# EAGLE design projet_micro_co (EAGLE 8.3.2)
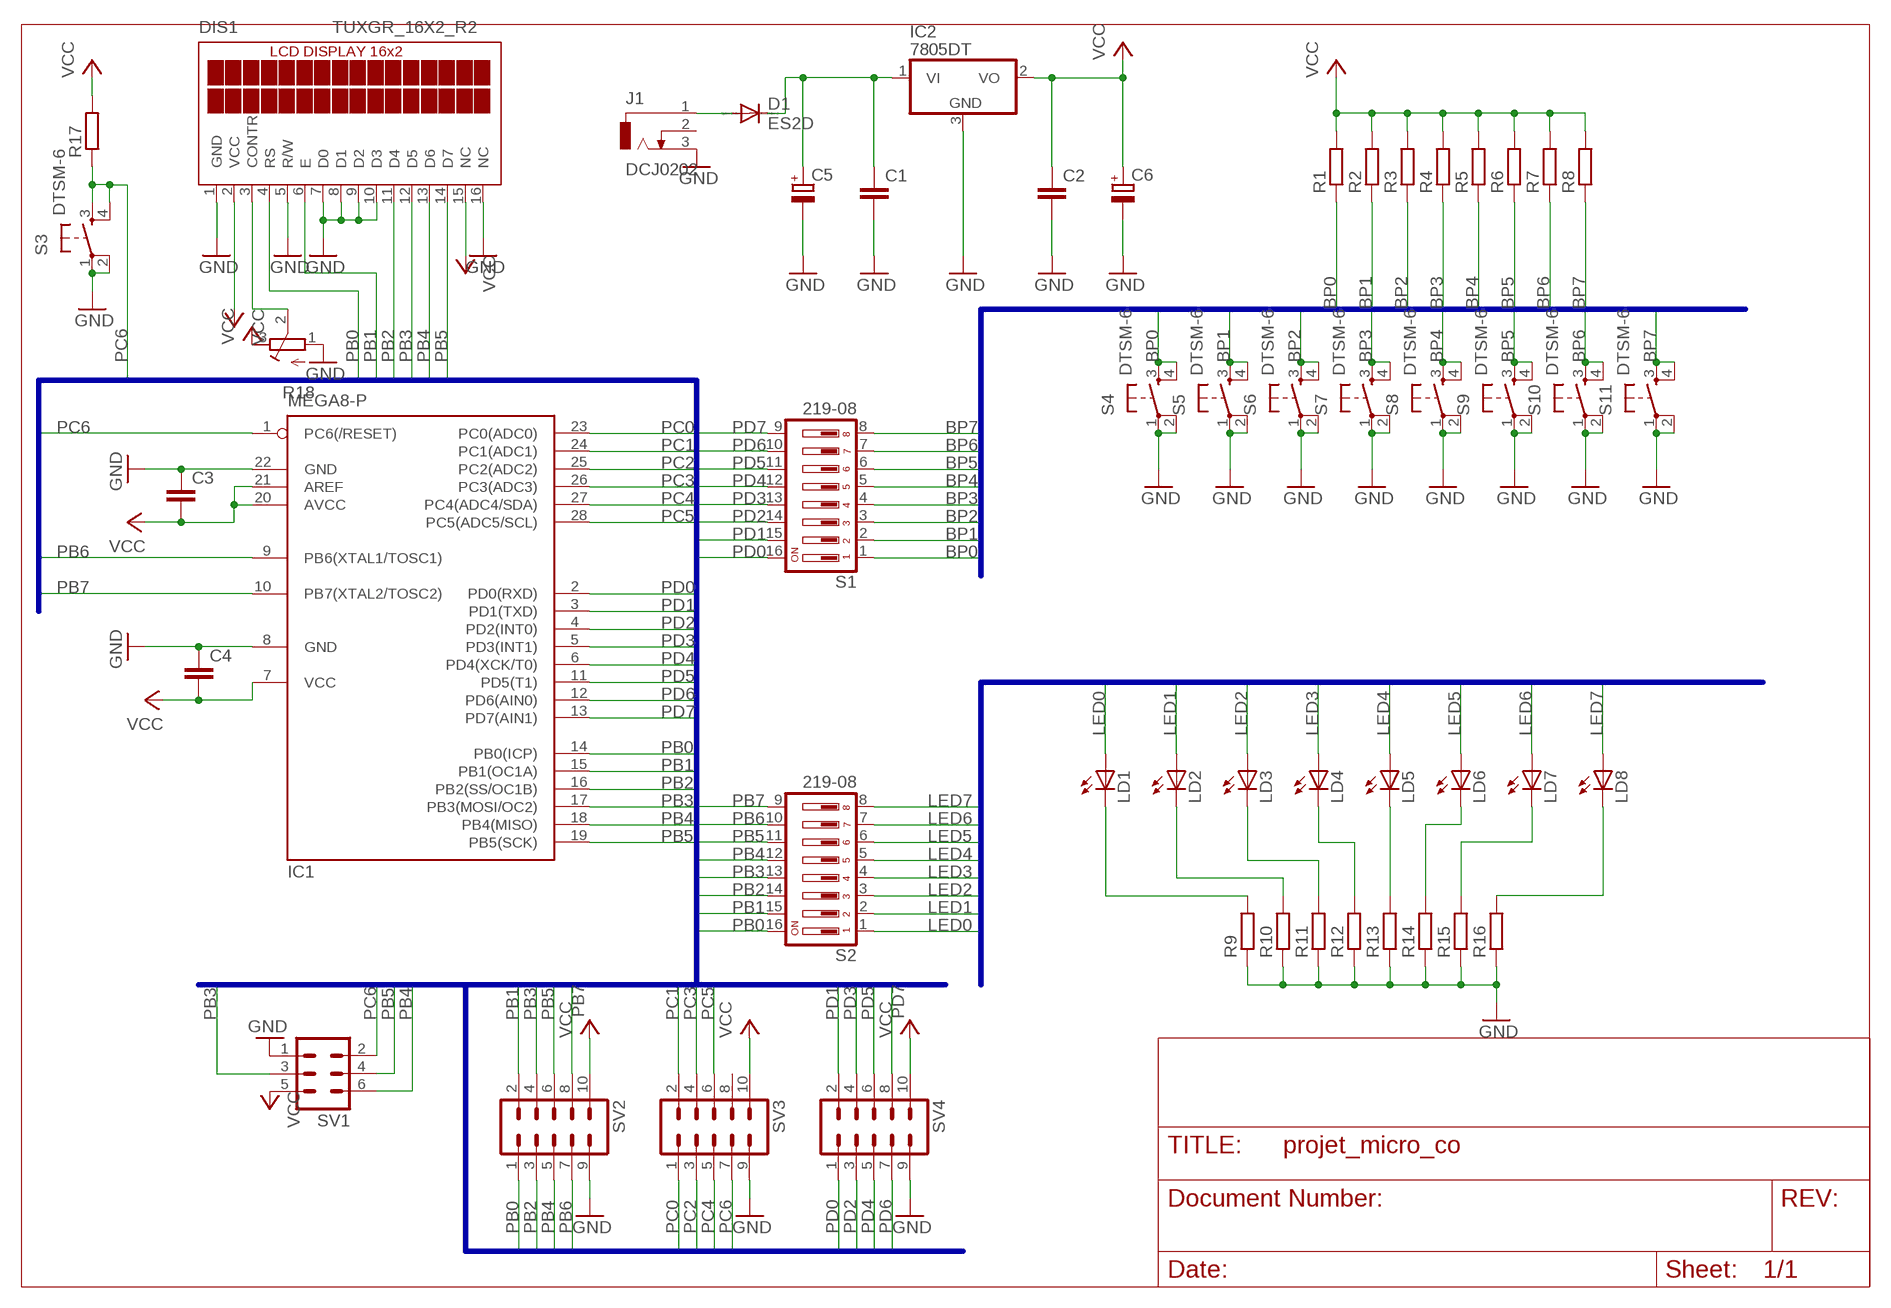
[diagram p0: schematic, sheet 1]

## Parts
C1  C-EUC1206  [C1206]
C2  C-EUC1206  [C1206]
C3  C-EUC1206  [C1206]
C4  C-EUC1206  [C1206]
C5  CPOL-EU153CLV-1010  [153CLV-1010]
C6  CPOL-EU153CLV-0605  [153CLV-0605]
D1  ES2D  [SMB]
DIS1  TUXGR_16X2_R2  [TUXGR_16X2_R2]
IC1  MEGA8-P  [DIL28-3]
IC2  7805DT  [TO252]
J1  DCJ0202  [DCJ0202]
LD1  LEDCHIPLED_1206  [CHIPLED_1206]
LD2  LEDCHIPLED_1206  [CHIPLED_1206]
LD3  LEDCHIPLED_1206  [CHIPLED_1206]
LD4  LEDCHIPLED_1206  [CHIPLED_1206]
LD5  LEDCHIPLED_1206  [CHIPLED_1206]
LD6  LEDCHIPLED_1206  [CHIPLED_1206]
LD7  LEDCHIPLED_1206  [CHIPLED_1206]
LD8  LEDCHIPLED_1206  [CHIPLED_1206]
R1  R-EU_M1206  [M1206]
R2  R-EU_M1206  [M1206]
R3  R-EU_M1206  [M1206]
R4  R-EU_M1206  [M1206]
R5  R-EU_M1206  [M1206]
R6  R-EU_M1206  [M1206]
R7  R-EU_M1206  [M1206]
R8  R-EU_M1206  [M1206]
R9  R-EU_M1206  [M1206]
R10  R-EU_M1206  [M1206]
R11  R-EU_M1206  [M1206]
R12  R-EU_M1206  [M1206]
R13  R-EU_M1206  [M1206]
R14  R-EU_M1206  [M1206]
R15  R-EU_M1206  [M1206]
R16  R-EU_M1206  [M1206]
R17  R-EU_M1206  [M1206]
R18  R-TRIMM4G/J  [RTRIM4G/J]
S1  219-08  [CTS-219-08]
S2  219-08  [CTS-219-08]
S3  DTSM-6  [DTSM-6]
S4  DTSM-6  [DTSM-6]
S5  DTSM-6  [DTSM-6]
S6  DTSM-6  [DTSM-6]
S7  DTSM-6  [DTSM-6]
S8  DTSM-6  [DTSM-6]
S9  DTSM-6  [DTSM-6]
S10  DTSM-6  [DTSM-6]
S11  DTSM-6  [DTSM-6]
SV1  ML6  [ML6]
SV2  MA05-2  [MA05-2]
SV3  MA05-2  [MA05-2]
SV4  MA05-2  [MA05-2]

## Nets
BP0: R1.1 S1.1 S4.3 S4.4
BP1: R2.1 S1.2 S5.3 S5.4
BP2: R3.1 S1.3 S6.3 S6.4
BP3: R4.1 S1.4 S7.3 S7.4
BP4: R5.1 S1.5 S8.3 S8.4
BP5: R6.1 S1.6 S9.3 S9.4
BP6: R7.1 S1.7 S10.3 S10.4
BP7: R8.1 S1.8 S11.3 S11.4
GND: C1.2 C2.2 C3.1 C4.1 C5.- C6.- DIS1.1(GND) DIS1.5(R/W) DIS1.7(D0) DIS1.8(D1) DIS1.9(D2) DIS1.10(D3) DIS1.16(NC) IC1.8(GND) IC1.22(GND) IC2.3(GND) J1.3 R9.1 R10.1 R11.1 R12.1 R13.1 R14.1 R15.1 R16.1 R18.1(A) S3.1 S3.2 S4.1 S4.2 S5.1 S5.2 S6.1 S6.2 S7.1 S7.2 S8.1 S8.2 S9.1 S9.2 S10.1 S10.2 S11.1 S11.2 SV1.1 SV2.9 SV3.9 SV4.9
LED0: LD1.A S2.1
LED1: LD2.A S2.2
LED2: LD3.A S2.3
LED3: LD4.A S2.4
LED4: LD5.A S2.5
LED5: LD6.A S2.6
LED6: LD7.A S2.7
LED7: LD8.A S2.8
N$1: DIS1.3(CONTR) R18.2(S)
N$2: D1.A J1.1
N$3: C1.1 C5.+ D1.C IC2.1(VI)
N$4: LD1.C R9.2
N$5: LD2.C R10.2
N$6: LD3.C R11.2
N$7: LD4.C R12.2
N$8: LD5.C R13.2
N$9: LD6.C R14.2
N$10: LD7.C R15.2
N$11: LD8.C R16.2
PB0: DIS1.4(RS) IC1.14(PB0(ICP)) S2.16 SV2.1
PB1: DIS1.6(E) IC1.15(PB1(OC1A)) S2.15 SV2.2
PB2: DIS1.11(D4) IC1.16(PB2(SS/OC1B)) S2.14 SV2.3
PB3: DIS1.12(D5) IC1.17(PB3(MOSI/OC2)) S2.13 SV1.3 SV2.4
PB4: DIS1.13(D6) IC1.18(PB4(MISO)) S2.12 SV1.6 SV2.5
PB5: DIS1.14(D7) IC1.19(PB5(SCK)) S2.11 SV1.4 SV2.6
PB6: IC1.9(PB6(XTAL1/TOSC1)) S2.10 SV2.7
PB7: IC1.10(PB7(XTAL2/TOSC2)) S2.9 SV2.8
PC0: IC1.23(PC0(ADC0)) SV3.1
PC1: IC1.24(PC1(ADC1)) SV3.2
PC2: IC1.25(PC2(ADC2)) SV3.3
PC3: IC1.26(PC3(ADC3)) SV3.4
PC4: IC1.27(PC4(ADC4/SDA)) SV3.5
PC5: IC1.28(PC5(ADC5/SCL)) SV3.6
PC6: IC1.1(PC6(/RESET)) R17.1 S3.3 S3.4 SV1.2 SV3.7
PD0: IC1.2(PD0(RXD)) S1.16 SV4.1
PD1: IC1.3(PD1(TXD)) S1.15 SV4.2
PD2: IC1.4(PD2(INT0)) S1.14 SV4.3
PD3: IC1.5(PD3(INT1)) S1.13 SV4.4
PD4: IC1.6(PD4(XCK/T0)) S1.12 SV4.5
PD5: IC1.11(PD5(T1)) S1.11 SV4.6
PD6: IC1.12(PD6(AIN0)) S1.10 SV4.7
PD7: IC1.13(PD7(AIN1)) S1.9 SV4.8
VCC: C2.1 C3.2 C4.2 C6.+ DIS1.2(VCC) DIS1.15(NC) IC1.7(VCC) IC1.20(AVCC) IC1.21(AREF) IC2.2(VO) R1.2 R2.2 R3.2 R4.2 R5.2 R6.2 R7.2 R8.2 R17.2 R18.3(E) SV1.5 SV2.10 SV3.10 SV4.10
Unconnected: J1.2 SV3.8

## Buses
PB[0..7],PC[0..7],PD[0..7]
BP[0..7]
LED[0..7]

## Library data of the parts
C1-C4 = rcl:C-EU: CAPACITOR, European symbol
C5 C6 = rcl:CPOL-EU: POLARIZED CAPACITOR, European symbol
D1 = diode:ES2D: DIODE super fast rectifier, 2 A
DIS1 = display-lcd:TUXGR_16X2_R2: Tuxgraphics LCD display 16x2 characters reflective, without background light Source: tuxgr_12x2_r2.pdf; OC_FARNELL: unknown; OC_NEWARK: unknown
IC1 = atmel:MEGA8-P: MICROCONTROLLER 8 Kbytes FLASH, 1 kbytes SRAM, 512 bytes EEPROM, USART, 4-channel 10 bit ADC, 2-channel 8 bit ADC Pin compatible with Atmega48, ATMega88, ATMega168 Source: avr.lbr; OC_FARNELL: unknown; OC_NEWARK: unknown
IC2 = linear:78*: Positive VOLTAGE REGULATOR Source: http://cache.national.com/ds/LM/LM78L05.pdf http://www.fairchildsemi.com/ds/LM/LM7805.pdf
J1 = con-jack:DCJ0202: DC POWER JACK Source: DCJ0202.pdf; OC_FARNELL: unknown; OC_NEWARK: unknown
LD1-LD8 = led:LED: LED OSRAM: - CHIPLED LG R971, LG N971, LY N971, LG Q971, LY Q971, LO R971, LY R971 LH N974, LH R974 LS Q976, LO Q976, LY Q976 LO Q996 - Hyper CHIPLED LW Q18S LB Q993, LB Q99A, LB R99A - SideLED LS A670, LO A670, LY A670, LG A670, LP A670 LB A673, LV A673, LT A673, LW A673 LH A674 LY A675 LS A676, LA A676, LO A676, LY A676, LW A676 LS A679, LY A679, LG A679 - Hyper Micro SIDELED® LS Y876, LA Y876, LO Y876, LY Y876 LT Y87S - SmartLED LW L88C, LW L88S LB L89C, LB L89S, LG L890 LS L89K, LO L89K, LY L89K LS L896, LA L896, LO L896, LY L896 - TOPLED LS T670, LO T670, LY T670, LG T670, LP T670 LSG T670, LSP T670, LSY T670, LOP T670, LYG T670 LG T671, LOG T671, LSG T671 LB T673, LV T673, LT T673, LW T673 LH T674 LS T676, LA T676, LO T676, LY T676, LB T676, LH T676, LSB T676, LW T676 LB T67C, LV T67C, LT T67C, LS T67K, LO T67K, LY T67K, LW E67C LS E67B, LA E67B, LO E67B, LY E67B, LB E67C, LV E67C, LT E67C LW T67C LS T679, LY T679, LG T679 LS T770, LO T770, LY T770, LG T770, LP T770 LB T773, LV T773, LT T773, LW T773 LH T774 LS E675, LA E675, LY E675, LS T675 LS T776, LA T776, LO T776, LY T776, LB T776 LHGB T686 LT T68C, LB T68C - Hyper Mini TOPLED® LB M676 - Mini TOPLED Santana® LG M470 LS M47K, LO M47K, LY M47K Source: http://www.osram.convergy.de/
R1-R17 = rcl:R-EU_: RESISTOR, European symbol
R18 = rcl:R-TRIMM: Trimm resistor
S1 S2 = switch-dil:219-08*: Surface Mount DIP Switch Series 219 SMT CTS Electronic Components Sourc: www.ctscorp.com; OC_FARNELL: unknown; OC_NEWARK: unknown
S3-S11 = switch-tact:DTSM-6
SV1 = con-ml:ML6: HARTING; OC_FARNELL: unknown; OC_NEWARK: unknown
SV2-SV4 = con-lstb:MA05-2: PIN HEADER; OC_FARNELL: unknown; OC_NEWARK: unknown

## Net classes
0 default: width 0.406 mm, drill 0.254 mm, clearance 0.305 mm
1 ground: width 0.61 mm, drill 0.254 mm, clearance 0.305 mm

## Board
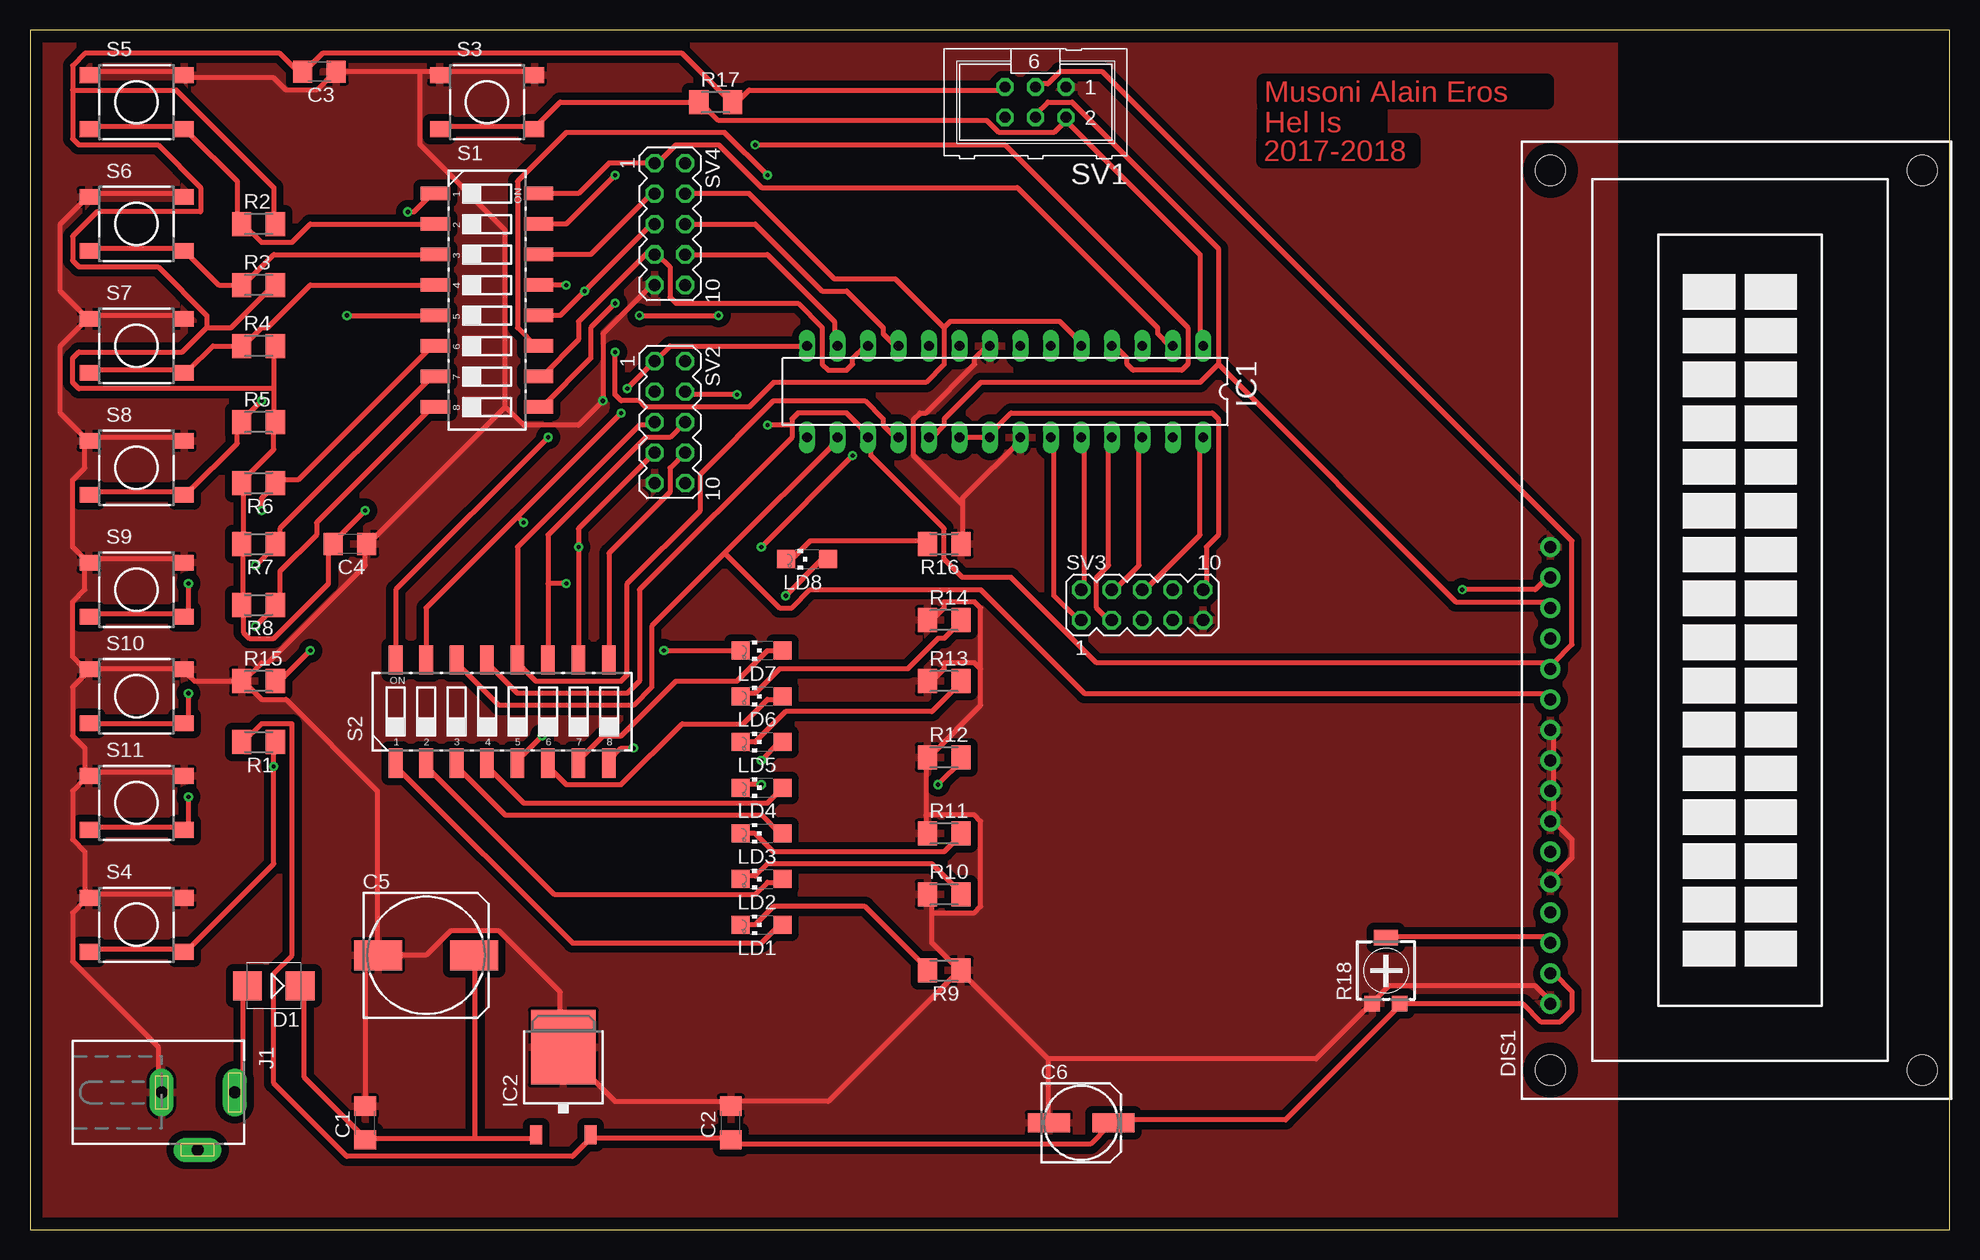
[diagram p1: board, top side]
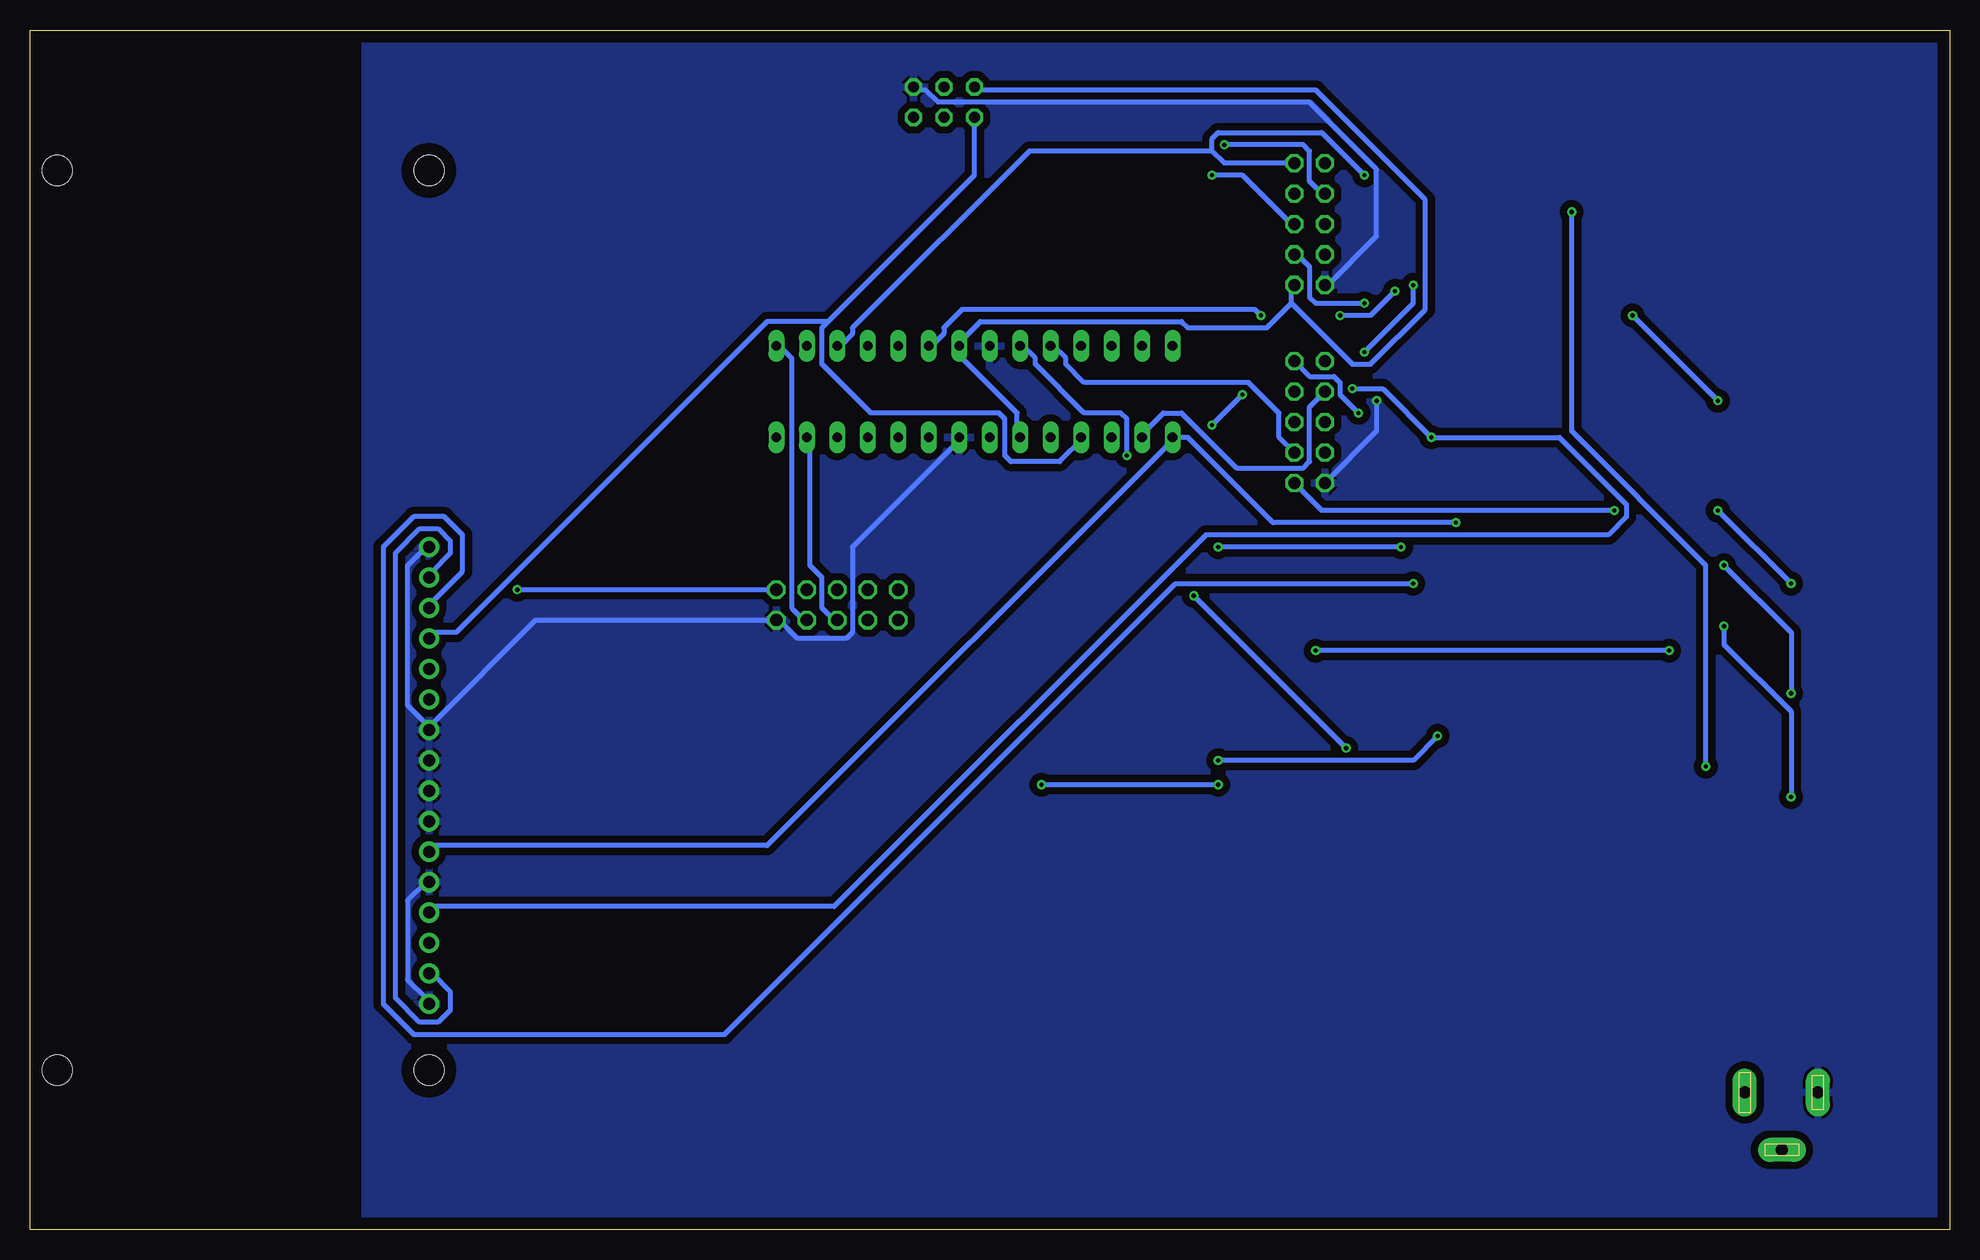
[diagram p2: board, bottom side, seen from below]

Size 160 x 100 mm. Coordinates in mm from the lower left corner, seen from the top.
Outline: 0,0 160,0 160,100 0,100 0,0
Copper layers (1*16): Top 0.035mm / dielectric 1.5mm / Bottom 0.035mm
Design rules "default *": minimum track width 6mil, minimum drill 0.35mm, track to track 24mil, track to pad 10mil, pad to pad 6mil, via to via 6mil, smd to smd 6mil, copper to edge 40mil, drill to drill 6mil, minimum pad ring 10mil, minimum via ring 8mil, stop-mask expansion 4mil, vias tented up to drill 0mil, thermal gap 10mil

### Footprints (pad centres in the part's own frame; a part is rotated, then mirrored left to right if it is on the bottom)
C1206 = smd 1.6 x 1.8: 1 -1.4,0; 2 1.4,0
153CLV-1010 = smd 4 x 2.5: + 4,0; - -4,0
153CLV-0605 = smd 3.5 x 1.6: + 2.7,0; - -2.7,0
SMB = smd 2.4 x 2.4: A 2.2,0; C -2.2,0
TUXGR_16X2_R2 = drill 1 pad 1.676: 1 -32,15.5; 2 -29.46,15.5; 3 -26.92,15.5; 4 -24.38,15.5; 5 -21.84,15.5; 6 -19.3,15.5; 7 -16.76,15.5; 8 -14.22,15.5; 9 -11.68,15.5; 10 -9.14,15.5; 11 -6.6,15.5; 12 -4.06,15.5; 13 -1.52,15.5; 14 1.02,15.5; 15 3.56,15.5; 16 6.1,15.5 | hole 2.5: -37.5,-15.5; 37.5,-15.5; -37.5,15.5; 37.5,15.5
DIL28-3 = drill 0.813 long: 1 -16.51,-3.81; 2 -13.97,-3.81; 3 -11.43,-3.81; 4 -8.89,-3.81; 5 -6.35,-3.81; 6 -3.81,-3.81; 7 -1.27,-3.81; 8 1.27,-3.81; 9 3.81,-3.81; 10 6.35,-3.81; 11 8.89,-3.81; 12 11.43,-3.81; 13 13.97,-3.81; 14 16.51,-3.81; 15 16.51,3.81; 16 13.97,3.81; 17 11.43,3.81; 18 8.89,3.81; 19 6.35,3.81; 20 3.81,3.81; 21 1.27,3.81; 22 -1.27,3.81; 23 -3.81,3.81; 24 -6.35,3.81; 25 -8.89,3.81; 26 -11.43,3.81; 27 -13.97,3.81; 28 -16.51,3.81
TO252 = smd 1 x 1.6: 1 -2.28,-4.8; 2 2.28,-4.8 | smd 5.4 x 6.2: 3 0,2.5
DCJ0202 = drill 1 pad 2 long: 1 0,3.1; 2 4.8,0; 3 0,-3
CHIPLED_1206 = smd 1.5 x 1.5: A 0,-1.75; C 0,1.75
M1206 = smd 1.6 x 2: 1 -1.4,0; 2 1.4,0
RTRIM4G/J = smd 1.3 x 1.3: 1 -1.15,-2.75; 3 1.15,-2.75 | smd 2 x 1.3: 2 0,2.75
CTS-219-08 = smd 1.13 x 2.44: 1 -8.89,-4.3; 2 -6.35,-4.3; 3 -3.81,-4.3; 4 -1.27,-4.3; 5 1.27,-4.3; 6 3.81,-4.3; 7 6.35,-4.3; 8 8.89,-4.3; 9 8.89,4.3; 10 6.35,4.3; 11 3.81,4.3; 12 1.27,4.3; 13 -1.27,4.3; 14 -3.81,4.3; 15 -6.35,4.3; 16 -8.89,4.3
DTSM-6 = smd 1.55 x 1.3: 1 -3.975,2.25; 2 3.975,2.25; 3 -3.975,-2.25; 4 3.975,-2.25
ML6 = drill 0.914 octagon: 1 -2.54,-1.27; 2 -2.54,1.27; 3 0,-1.27; 4 0,1.27; 5 2.54,-1.27; 6 2.54,1.27
MA05-2 = drill 1.016 octagon: 1 -5.08,-1.27; 2 -5.08,1.27; 3 -2.54,-1.27; 4 -2.54,1.27; 5 0,-1.27; 6 0,1.27; 7 2.54,-1.27; 8 2.54,1.27; 9 5.08,-1.27; 10 5.08,1.27

### Placement (x,y rotation side)
C1  27.94,8.89 90 top
C2  58.42,8.89 90 top
C3  24.13,96.52 180 top
C4  26.67,57.15 180 top
C5  33.02,22.86 0 top
C6  87.63,8.89 0 top
D1  20.32,20.32 180 top
DIS1  142.24,50.8 90 top
IC1  81.28,69.85 180 top
IC2  44.45,12.7 0 top
J1  13.97,11.43 270 top
LD1  60.96,25.4 90 top
LD2  60.96,29.21 90 top
LD3  60.96,33.02 90 top
LD4  60.96,36.83 90 top
LD5  60.96,40.64 90 top
LD6  60.96,44.45 90 top
LD7  60.96,48.26 90 top
LD8  64.77,55.88 90 top
R1  19.05,40.64 180 top
R2  19.05,83.82 0 top
R3  19.05,78.74 0 top
R4  19.05,73.66 0 top
R5  19.05,67.31 0 top
R6  19.05,62.23 180 top
R7  19.05,57.15 180 top
R8  19.05,52.07 180 top
R9  76.2,21.59 180 top
R10  76.2,27.94 0 top
R11  76.2,33.02 0 top
R12  76.2,39.37 0 top
R13  76.2,45.72 0 top
R14  76.2,50.8 0 top
R15  19.05,45.72 0 top
R16  76.2,57.15 180 top
R17  57.15,93.98 0 top
R18  113.03,21.59 0 top
S1  38.1,77.47 270 top
S2  39.37,43.18 0 top
S3  38.1,93.98 0 top
S4  8.89,25.4 0 top
S5  8.89,93.98 0 top
S6  8.89,83.82 0 top
S7  8.89,73.66 0 top
S8  8.89,63.5 0 top
S9  8.89,53.34 0 top
S10  8.89,44.45 0 top
S11  8.89,35.56 0 top
SV1  83.82,93.98 180 top
SV2  53.34,67.31 270 top
SV3  92.71,52.07 0 top
SV4  53.34,83.82 270 top

### Tracks (layer width: path | path; a pad name or v marks a point on that pad's centre or on a via)
BP0  (via drill 0.35)
  Top 0.406: S4.3 5.08,23.37 12.7,23.37 S4.4 13.21,23.37 20.32,30.48 v20.32,38.61 20.32,40.64 R1.1 | v31.5,84.84 32,84.84 33.53,86.36 S1.1
  Bottom 0.406: v31.5,84.84 31.5,66.55 20.32,55.37 v20.32,38.61
BP1
  Top 0.406: S5.3 5.08,91.95 12.7,91.95 S5.4 13.21,91.44 17.27,87.38 17.27,83.82 R2.1 17.78,83.82 19.3,82.3 21.84,82.3 23.37,83.82 S1.2
BP2
  Top 0.406: S6.3 5.08,81.79 12.7,81.79 S6.4 13.21,81.28 15.75,78.74 R3.1 17.78,78.74 20.32,81.28 S1.3
BP3
  Top 0.406: S7.3 5.08,71.63 12.7,71.63 S7.4 13.21,71.63 15.24,73.66 R4.1 17.78,73.66 19.3,75.18 19.81,75.18 23.37,78.74 S1.4
BP4  (via drill 0.35)
  Top 0.406: S8.3 5.08,61.47 12.7,61.47 S8.4 13.21,61.47 17.27,65.53 17.27,67.06 R5.1 17.78,67.56 v19.3,69.09 | v26.42,76.2 S1.5
  Bottom 0.406: v19.3,69.09 v26.42,76.2
BP5  (via drill 0.35)
  Top 0.406: S9.3 5.08,51.31 12.7,51.31 S9.4 13.21,51.31 v13.21,53.85 | S1.6 33.53,73.66 22.35,62.48 20.83,62.48 R6.1 20.32,61.98 19.3,60.96 v19.3,59.94
  Bottom 0.406: v19.3,59.94 v13.21,53.85
BP6  (via drill 0.35)
  Top 0.406: S10.3 5.08,42.16 12.7,42.16 S10.4 13.21,42.67 v13.21,44.7 | S1.7 33.53,71.12 20.83,58.42 20.83,57.4 R7.1 20.32,56.9 v18.8,55.37
  Bottom 0.406: v13.21,44.7 13.21,49.78 v18.8,55.37
BP7  (via drill 0.35)
  Top 0.406: S11.3 5.08,33.53 12.7,33.53 S11.4 13.21,33.53 v13.21,36.07 | S1.8 33.53,68.58 23.88,58.93 23.88,57.91 20.83,54.86 20.83,52.32 R8.1 20.32,51.82 v18.8,50.29
  Bottom 0.406: v13.21,36.07 13.21,43.18 18.8,48.77 v18.8,50.29
GND  (via drill 0.35)
  Top 0.406: C1.2 27.94,21.84 28.96,22.86 | 58.42,10.67 48.77,10.67 44.7,14.73 IC2.3 44.2,15.24 44.2,19.81 39.12,24.89 35.05,24.89 33.02,22.86 C5.- 28.96,22.86 | 74.68,34.54 74.68,39.12 R12.1 75.18,39.62 79.25,43.69 79.25,46.74 | 74.68,34.54 74.68,33.02 R11.1 | 79.25,46.74 78.74,47.24 76.2,47.24 76.2,46.74 75.18,45.72 R13.1 | 79.25,46.74 79.25,51.82 78.74,52.32 76.2,52.32 76.2,51.82 75.18,50.8 R14.1 | 75.18,26.42 75.18,23.88 77.22,21.84 R9.1 | 75.18,26.42 75.18,27.94 R10.1 | 84.84,14.22 84.84,9.14 C6.- | 84.84,14.22 77.72,21.34 R9.1 | 74.68,34.54 78.74,34.54 79.25,34.04 79.25,26.92 78.74,26.42 75.18,26.42 | 58.42,10.67 66.55,10.67 77.22,21.34 R9.1 | 58.42,10.67 C2.2 | 77.72,60.45 77.72,60.96 82.8,66.04 IC1.22 | 77.72,60.45 77.72,57.4 R16.1 | 77.72,60.45 73.66,64.52 73.66,67.56 74.17,68.07 74.68,68.07 78.74,72.14 78.74,72.64 79.76,73.66 IC1.8 | DIS1.1 126.49,19.3 125.48,20.32 113.28,20.32 112.27,19.3 R18.1 111.76,18.8 107.19,14.22 84.84,14.22 | DIS1.5 127,29.46 128.52,30.99 128.52,32.51 127,34.04 DIS1.7 127,34.54 127,36.58 DIS1.8 127,37.08 127,39.12 DIS1.9 127,39.62 127,41.66 DIS1.10 | S4.1 5.08,27.94 12.7,27.94 S4.2 | J1.3 10.67,11.68 10.67,15.24 3.56,22.35 3.56,26.42 4.57,27.43 S4.1 | 17.78,45.72 19.3,47.24 19.81,47.24 27.94,55.37 27.94,56.9 C4.1 28.45,57.4 39.62,68.58 | S6.2 12.7,86.36 5.08,86.36 S6.1 4.57,85.85 2.54,83.82 2.54,78.23 4.57,76.2 S7.1 | S7.1 5.08,76.2 12.7,76.2 S7.2 | S8.1 5.08,66.04 12.7,66.04 S8.2 | S9.1 5.08,55.88 12.7,55.88 S9.2 | S11.1 5.08,38.1 12.7,38.1 S11.2 | S10.1 5.08,46.74 12.7,46.74 S10.2 13.21,46.23 13.72,45.72 R15.1 17.78,45.72 | S11.1 4.57,38.1 4.57,40.13 3.56,41.15 3.56,45.21 4.57,46.23 S10.1
  Top 0.406: S9.1 4.57,55.37 4.57,53.34 3.56,52.32 3.56,47.75 4.57,46.74 S10.1 | S8.1 4.57,65.53 4.57,63.5 3.56,62.48 3.56,56.9 4.57,55.88 S9.1 | S7.1 4.57,75.69 2.54,73.66 2.54,68.07 4.57,66.04 S8.1 | S4.1 4.57,27.94 4.57,31.5 3.56,32.51 3.56,36.58 4.57,37.59 S11.1 | S5.1 5.08,96.52 12.7,96.52 S5.2 13.21,96.01 20.32,96.01 21.34,95 23.88,95 25.4,96.52 C3.1 32.51,96.52 | S3.2 41.66,96.52 34.54,96.52 S3.1 34.04,96.52 32.51,96.52 | SV4.9 51.82,78.74 47.75,74.68 v47.75,69.09 45.72,67.06 41.15,67.06 39.62,68.58 | 32.51,96.52 32.51,90.42 39.62,83.31 39.62,68.58 | 28.96,22.86 28.96,36.58 21.34,44.2 19.3,44.2 17.78,45.72
  Bottom 0.406: IC1.22 82.3,66.04 91.44,56.9 91.44,49.78 91.95,49.28 96.01,49.28 97.54,50.8 SV3.9 117.86,50.8 126.49,42.16 DIS1.10 127,42.16 128.52,43.69 128.52,55.37 127,56.9 DIS1.16 | DIS1.1 127,19.3 128.52,20.83 128.52,27.43 127,28.96 DIS1.5 | SV1.1 86.36,95 85.34,95 84.33,93.98 53.34,93.98 47.75,88.39 47.75,82.8 51.82,78.74 SV4.9 | SV2.9 47.75,66.55 v47.75,69.09
  pour Top: 0.2,99.77 132.08,99.77 132.08,0.61 0.2,0.61
  pour Bottom: 0.2,99.77 132.08,99.77 132.08,0.61 0.2,0.61
LED0
  Top 0.406: LD1.A 62.48,25.4 60.96,23.88 45.21,23.88 30.48,38.61 S2.1
LED1
  Top 0.406: LD2.A 62.48,28.96 61.47,28.96 60.45,27.94 43.69,27.94 33.02,38.61 S2.2
LED2
  Top 0.406: LD3.A 62.48,33.02 60.96,34.54 39.62,34.54 35.56,38.61 S2.3
LED3
  Top 0.406: LD4.A 62.48,36.58 61.47,35.56 41.15,35.56 38.1,38.61 S2.4
LED4  (via drill 0.35)
  Top 0.406: v60.96,39.12 62.48,40.64 LD5.A | v42.67,41.15 40.64,39.12 S2.5
  Bottom 0.406: v60.96,39.12 44.7,39.12 v42.67,41.15
LED5
  Top 0.406: LD6.A 62.48,44.2 61.47,44.2 59.44,42.16 54.36,42.16 49.28,37.08 44.7,37.08 43.18,38.61 S2.6
LED6
  Top 0.406: LD7.A 61.47,48.26 58.93,45.72 53.85,45.72 49.28,41.15 47.75,41.15 45.72,39.12 S2.7
LED7  (via drill 0.35)
  Top 0.406: v62.99,52.83 66.04,55.88 LD8.A | v50.29,40.13 49.28,40.13 48.26,39.12 S2.8
  Bottom 0.406: v50.29,40.13 v62.99,52.83
N$1
  Top 0.406: R18.2 113.28,24.38 126.49,24.38 DIS1.3
N$2
  Top 0.406: D1.A 17.78,20.32 17.78,12.19 17.27,11.68 J1.1
N$3
  Top 0.406: 27.94,7.62 37.08,7.62 | 37.08,7.62 42.16,7.62 IC2.1 | 27.94,7.62 22.86,12.7 22.86,20.32 D1.C | 27.94,7.62 C1.1 | 37.08,7.62 37.08,22.86 C5.+
N$4
  Top 0.406: LD1.C 60.45,25.4 61.98,26.92 69.6,26.92 74.68,21.84 R9.2
N$5
  Top 0.406: LD2.C 59.44,29.46 60.45,29.46 61.47,30.48 75.18,30.48 77.72,27.94 R10.2
N$6
  Top 0.406: LD3.C 60.45,33.02 61.98,31.5 76.2,31.5 77.72,33.02 R11.2
N$7  (via drill 0.35)
  Top 0.406: v60.96,37.08 59.44,37.08 LD4.C | v75.69,37.08 77.72,39.12 R12.2
  Bottom 0.406: v75.69,37.08 v60.96,37.08
N$8
  Top 0.406: LD5.C 60.45,40.64 62.99,43.18 75.18,43.18 77.72,45.72 R13.2
N$9
  Top 0.406: LD6.C 59.44,44.7 60.45,44.7 62.48,46.74 73.15,46.74 75.69,49.28 76.2,49.28 77.72,50.8 R14.2
N$10  (via drill 0.35)
  Top 0.406: v52.83,48.26 LD7.C | v23.37,48.26 20.83,45.72 R15.2
  Bottom 0.406: v23.37,48.26 v52.83,48.26
N$11
  Top 0.406: LD8.C 63.5,55.88 65.02,57.4 74.68,57.4 R16.2
PB0  (via drill 0.35)
  Top 0.406: S2.16 30.48,53.34 v43.18,66.04 | v49.78,70.1 SV2.1 53.34,73.66 IC1.14
  Bottom 0.406: v49.78,70.1 47.24,70.1 v43.18,66.04 32.51,66.04 26.92,60.45 26.92,59.44 28.45,57.91 61.98,57.91 92.96,26.92 126.49,26.92 DIS1.4
PB1  (via drill 0.35)
  Top 0.406: S2.15 33.02,51.82 40.64,59.44 | v49.28,68.07 40.64,59.44 | 40.64,59.44 v41.15,58.93
  Bottom 0.406: v49.28,68.07 50.8,69.6 50.8,70.61 51.31,71.12 53.34,71.12 SV2.2 | 64.52,66.04 63.5,66.04 56.39,58.93 v41.15,58.93 | 64.52,66.04 98.55,32 126.49,32 DIS1.6 | 64.52,66.04 IC1.15
PB2
  Top 0.406: 57.91,56.39 67.56,66.04 IC1.16 | 57.91,56.39 51.82,50.29 51.82,45.21 50.29,43.69 39.12,43.69 35.56,47.24 S2.14 | 57.91,56.39 62.48,51.82 63.5,51.82 65.02,53.34 79.25,53.34 87.88,44.7 126.49,44.7 DIS1.11
  Bottom 0.406: SV2.3 53.34,68.58 53.34,64.01 53.85,63.5 59.44,63.5 64.01,68.07 65.53,68.07 67.56,66.04 IC1.16
PB3  (via drill 0.35)
  Top 0.406: 63.5,67.06 63.5,67.56 64.01,68.07 68.07,68.07 70.1,66.04 | 63.5,67.06 63.5,66.04 50.8,53.34 50.8,45.72 49.78,44.7 40.64,44.7 38.1,47.24 S2.13 | v58.93,69.6 54.86,69.6 SV2.4 | 63.5,67.06 v61.47,67.06 | SV1.3 83.82,95.5 84.84,95.5 85.85,96.52 89.41,96.52 128.52,57.4 128.52,48.77 127,47.24 DIS1.12 126.49,47.24 88.9,47.24 81.79,54.36 77.72,54.36 76.2,55.88 76.2,58.42 70.1,64.52 70.1,66.04 | 70.1,66.04 IC1.17
  Bottom 0.406: v61.47,67.06 v58.93,69.6
PB4
  Top 0.406: SV2.5 51.82,67.06 50.8,67.06 40.64,56.9 S2.12 40.64,47.24 42.16,45.72 49.28,45.72 49.78,46.23 49.78,53.85 55.88,59.94 55.88,62.99 61.98,69.09 69.6,69.09 71.12,67.56 71.12,67.06 72.14,66.04 IC1.18
  Bottom 0.406: SV1.6 81.28,87.88 93.47,75.69 | 93.47,75.69 93.98,75.18 93.98,72.14 89.92,68.07 79.25,68.07 78.74,67.56 78.74,64.52 78.23,64.01 74.17,64.01 72.14,66.04 IC1.18 | 93.47,75.69 98.55,75.69 124.46,49.78 126.49,49.78 DIS1.13
PB5  (via drill 0.35)
  Top 0.406: 43.18,53.85 43.18,57.91 51.31,66.04 53.34,66.04 SV2.6 | 43.18,53.85 S2.11 | 99.06,72.14 97.54,70.61 79.25,70.61 76.2,67.56 76.2,67.06 75.18,66.04 IC1.19 | 99.06,72.14 99.06,81.79 86.87,93.98 84.84,93.98 83.82,92.96 SV1.4 | 99.06,72.14 118.87,52.32 126.49,52.32 DIS1.14 | v44.7,53.85 43.18,53.85
  Bottom 0.406: v44.7,53.85 64.52,53.85 102.11,16.26 128.02,16.26 130.56,18.8 130.56,56.9 128.02,59.44 125.48,59.44 123.95,57.91 123.95,54.86 126.49,52.32 DIS1.14
PB6  (via drill 0.35)
  Top 0.406: S2.10 v45.72,56.9 45.72,58.42 SV2.7 | v60.96,56.9 v68.58,64.52
  Bottom 0.406: v68.58,64.52 68.58,67.56 69.09,68.07 72.14,68.07 76.2,72.14 76.2,72.64 77.22,73.66 IC1.9 | v45.72,56.9 v60.96,56.9
PB7
  Top 0.406: S2.9 48.26,56.39 53.34,61.47 53.34,63.5 SV2.8
  Bottom 0.406: SV2.8 55.88,66.04 55.88,68.07 58.42,70.61 72.14,70.61 73.66,72.14 73.66,72.64 74.68,73.66 IC1.10
PC0
  Top 0.406: IC1.23 85.34,66.04 85.34,52.83 87.38,50.8 SV3.1
PC1
  Top 0.406: IC1.24 87.88,66.04 87.88,53.34 SV3.2
PC2
  Top 0.406: IC1.25 89.92,66.04 89.92,55.37 88.9,54.36 88.9,51.82 89.92,50.8 SV3.3
PC3
  Top 0.406: IC1.26 92.46,66.04 92.46,55.37 90.42,53.34 SV3.4
PC4
  Bottom 0.406: IC1.27 95,66.04 95,55.37 93.98,54.36 93.98,51.82 92.96,50.8 SV3.5
PC5
  Top 0.406: IC1.28 97.54,66.04 97.54,57.91 92.96,53.34 SV3.6
PC6
  Top 0.406: S3.3 34.54,91.95 41.66,91.95 S3.4 42.16,91.95 44.2,93.98 R17.1 55.88,93.98 57.4,92.46 79.76,92.46 80.77,91.44 85.34,91.44 86.36,92.46 | 86.36,92.46 97.54,81.28 97.54,73.66 IC1.1 | 86.36,92.46 SV1.2
  Bottom 0.406: SV3.7 95.5,50.8 96.52,51.82 96.52,72.64 97.54,73.66 IC1.1
PD0
  Top 0.406: S1.16 45.72,86.36 48.26,88.9 SV4.1 52.32,88.9 53.85,90.42 57.4,90.42 60.96,86.87 82.3,86.87 93.98,75.18 93.98,74.68 95,73.66 IC1.2
PD1  (via drill 0.35)
  Top 0.406: S1.15 44.7,83.82 v48.77,87.88
  Bottom 0.406: v48.77,87.88 52.32,91.44 60.96,91.44 61.47,90.93 61.47,89.92 | 61.47,89.92 60.45,88.9 SV4.2 | 61.47,89.92 76.71,89.92 91.44,75.18 91.44,74.68 92.46,73.66 IC1.3
PD2  (via drill 0.35)
  Top 0.406: S1.14 46.74,81.28 51.82,86.36 SV4.3 | v60.45,90.42 81.28,90.42 96.52,75.18 96.52,72.14 96.01,71.63 91.95,71.63 91.44,72.14 91.44,72.64 90.42,73.66 IC1.4
  Bottom 0.406: v60.45,90.42 53.85,90.42 53.34,89.92 53.34,87.38 52.32,86.36 SV4.3
PD3  (via drill 0.35)
  Top 0.406: v44.7,78.74 S1.13 | v48.77,73.15 48.77,69.6 49.28,69.09 50.8,69.09 51.31,68.58 59.94,68.58 61.98,70.61 74.68,70.61 76.2,72.14 76.2,75.18 | 76.2,75.18 76.71,75.69 85.85,75.69 87.88,73.66 IC1.5 | SV4.4 59.94,86.36 67.06,79.25 72.14,79.25 76.2,75.18
  Bottom 0.406: v44.7,78.74 44.7,77.22 v48.77,73.15
PD4  (via drill 0.35)
  Top 0.406: S1.12 44.2,76.2 v46.23,78.23 51.82,83.82 SV4.5 | v50.8,76.2 v57.4,76.2
  Bottom 0.406: v57.4,76.2 57.91,76.71 82.3,76.71 83.82,75.18 83.82,74.68 84.84,73.66 IC1.6 | v50.8,76.2 48.26,76.2 v46.23,78.23
PD5  (via drill 0.35)
  Top 0.406: v61.47,87.88 57.91,91.44 44.7,91.44 40.64,87.38 40.64,75.18 42.16,73.66 S1.11 | SV4.6 60.45,83.82 66.04,78.23 68.07,78.23 71.12,75.18 71.12,74.68 72.14,73.66 IC1.11
  Bottom 0.406: v61.47,87.88 58.93,87.88 54.86,83.82 SV4.6
PD6
  Top 0.406: S1.10 42.67,71.12 45.72,74.17 45.72,75.69 51.31,81.28 SV4.7 52.32,81.28 53.34,80.26 53.34,77.72 53.85,77.22 64.01,77.22 66.04,75.18 66.04,72.14 66.55,71.63 68.07,71.63 68.58,72.14 68.58,72.64 69.6,73.66 IC1.12
PD7  (via drill 0.35)
  Top 0.406: v48.77,77.22 46.74,75.18 46.74,72.64 42.67,68.58 S1.9 | SV4.8 61.47,81.28 67.06,75.69 67.06,73.66 IC1.13
  Bottom 0.406: v48.77,77.22 52.83,77.22 53.34,77.72 53.34,80.26 54.36,81.28 SV4.8
VCC  (via drill 0.35)
  Top 0.406: 20.32,70.1 20.32,73.66 R4.2 | 20.32,70.1 20.32,67.56 R5.2 20.32,67.06 20.32,65.02 17.78,62.48 R6.2 17.78,61.98 17.78,57.4 R7.2 17.78,56.9 17.78,52.32 R8.2 17.78,51.82 17.78,49.78 18.29,49.28 20.32,49.28 24.89,53.85 24.89,56.9 C4.2 25.4,57.4 v27.94,59.94 | 14.73,75.18 16.76,75.18 20.32,78.74 R3.2 | 14.73,75.18 12.7,73.15 4.06,73.15 3.56,72.64 3.56,70.61 4.06,70.1 20.32,70.1 | 3.56,95 12.19,95 20.32,86.87 20.32,83.82 R2.2 | 3.56,95 3.56,97.03 4.57,98.04 20.83,98.04 22.35,96.52 C3.2 22.86,96.52 24.38,98.04 54.36,98.04 58.42,93.98 R17.2 58.93,93.98 59.94,95 81.28,95 SV1.5 | 14.73,75.18 14.73,76.2 10.67,80.26 4.06,80.26 3.56,80.77 3.56,82.8 5.59,84.84 14.22,84.84 14.22,86.87 10.67,90.42 4.06,90.42 3.56,90.93 3.56,95 | 46.74,7.62 58.42,7.62 C2.1 58.42,7.11 88.39,7.11 89.92,8.64 C6.+ 90.42,9.14 104.65,9.14 114.3,18.8 | 46.74,7.62 45.21,6.1 26.42,6.1 20.32,12.19 20.32,21.34 21.84,22.86 21.84,42.16 19.3,42.16 17.78,40.64 R1.2 | 46.74,7.62 IC2.2 | 79.76,66.04 IC1.20 | 79.76,66.04 81.79,68.07 98.55,68.07 99.06,67.56 99.06,57.91 98.04,56.9 98.04,53.34 SV3.10 | 79.76,66.04 IC1.21 | 114.3,18.8 124.46,18.8 125.98,17.27 127.51,17.27 128.52,18.29 128.52,19.81 127,21.34 DIS1.2 | 114.3,18.8 R18.3 | v119.38,53.34 125.48,53.34 126.49,54.36 DIS1.15
  Bottom 0.406: SV2.10 52.32,59.94 v27.94,59.94 | IC1.20 77.72,66.04 77.72,68.07 82.3,72.64 82.3,73.66 IC1.7 82.8,73.66 80.77,75.69 64.01,75.69 63.5,75.18 56.9,75.18 54.86,77.22 | 54.86,77.22 54.86,78.74 SV4.10 | DIS1.15 126.49,54.86 124.97,56.39 124.97,57.4 125.98,58.42 127.51,58.42 129.54,56.39 129.54,19.3 127.51,17.27 125.98,17.27 124.97,18.29 124.97,19.81 126.49,21.34 DIS1.2 | v119.38,53.34 SV3.10 | 54.86,77.22 49.78,72.14 48.26,72.14 43.69,76.71 43.69,85.85 52.83,95 81.28,95 SV1.5

### Text on the board
Top: Musoni Alain Eros | Hel Is | 2017-2018